# EAGLE schematic SARA-R5 (EAGLE 9.5.1)

## Sheet 1 of 2
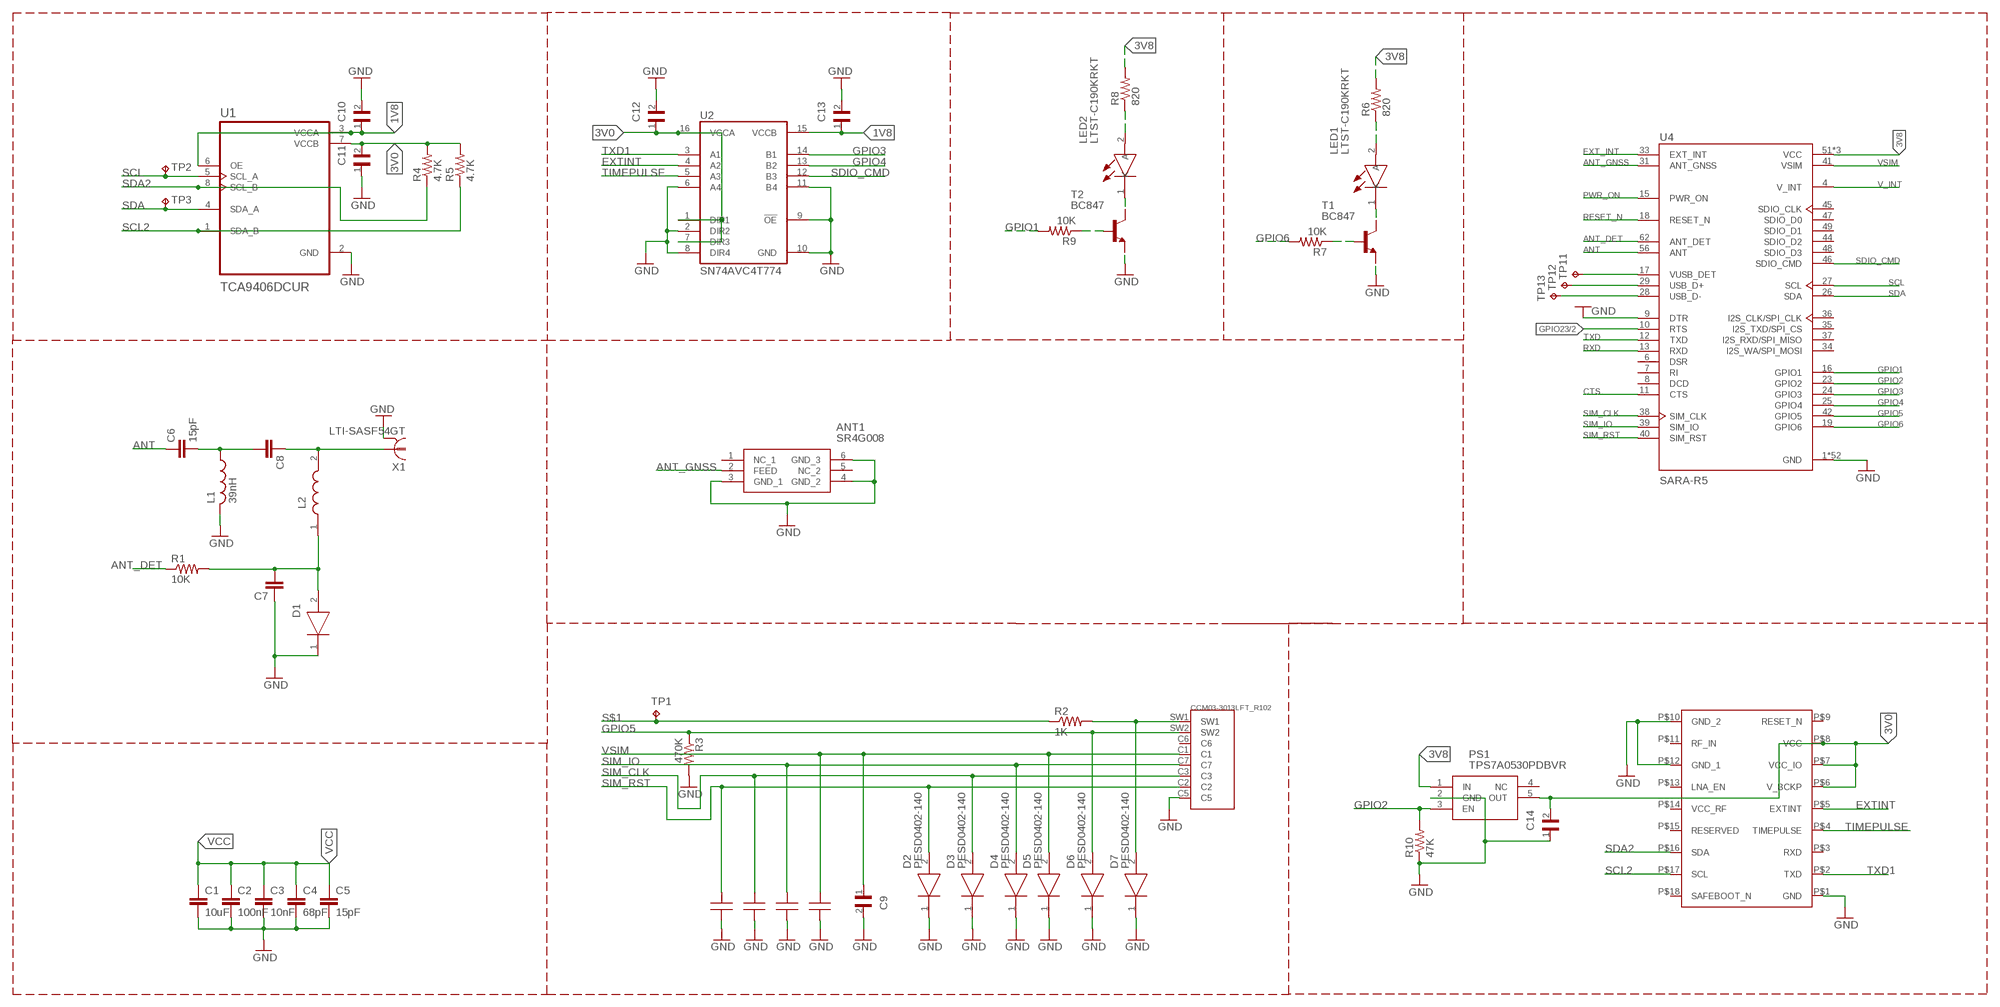
[diagram p0: schematic, sheet 1]

### Parts
ANT1  SR4G008  [SR4G008]
C1  10uF  C-EUC0402  [C0402]
C2  100nF  C-EUC0402  [C0402]
C3  10nF  C-EUC0402  [C0402]
C4  68pF  C-EUC0402  [C0402]
C5  15pF  C-EUC0402  [C0402]
C6  15pF  C-EUC0402  [C0402]
C7  27pF GRM1555C1H270JA16  C-EUC0402  [C0402]
C8  33pF GRM1555C1H330JA16  C-EUC0402  [C0402]
C9  GCM155R71C104KA55J  [CAPC1005X55N]
C10  GCM155R71C104KA55J  [CAPC1005X55N]
C11  GCM155R71C104KA55J  [CAPC1005X55N]
C12  GCM155R71C104KA55J  [CAPC1005X55N]
C13  GCM155R71C104KA55J  [CAPC1005X55N]
C14  GCM155R71C104KA55J  [CAPC1005X55N]
D1  PESD0402-140  [DIONC1005X43N]
D2  PESD0402-140  [DIONC1005X43N]
D3  PESD0402-140  [DIONC1005X43N]
D4  PESD0402-140  [DIONC1005X43N]
D5  PESD0402-140  [DIONC1005X43N]
D6  PESD0402-140  [DIONC1005X43N]
D7  PESD0402-140  [DIONC1005X43N]
L1  39nH  L-USL0402  [L0402]
L2  LQG15HS68NJ02B  [LQG15WH0N7B02D]
LED1  LTST-C190KRKT  [LEDC1608X80N]
LED2  LTST-C190KRKT  [LEDC1608X80N]
PS1  TPS7A0530PDBVR  [SOT95P280X145-5N]
R1  10K  R-US_R0402  [R0402]
R2  1K  R-US_R0402  [R0402]
R3  470K  R-US_R0402  [R0402]
R4  4.7K  R-US_R0402  [R0402]
R5  4.7K  R-US_R0402  [R0402]
R6  820  R-US_R0402  [R0402]
R7  10K  R-US_R0402  [R0402]
R8  820  R-US_R0402  [R0402]
R9  10K  R-US_R0402  [R0402]
R10  47K  R-US_R0402  [R0402]
T1  BC847  [SOT23]
T2  BC847  [SOT23]
TP1  TPB2,54  [B2,54]
TP2  TPB1,27  [B1,27]
TP3  TPB1,27  [B1,27]
TP11  TPB1,27  [B1,27]
TP12  TPB1,27  [B1,27]
TP13  TPB1,27  [B1,27]
U1  TCA9406DCUR  [SOP50P310X90-8N]
U2  SN74AVC4T774  [TSSOP16]
U4  SARA-R5  [SARA-R5]
U$1  GRM1555C1E680JA01  [INDC1005X45]
U$2  GRM1555C1E680JA01  [INDC1005X45]
U$3  GRM1555C1E680JA01  [INDC1005X45]
U$4  GRM1555C1E680JA01  [INDC1005X45]
U$5  MAX-8  [MAX-8]
X1  LTI-SASF54GT  [LTI-SASF54GT]
X2  CCM03-3013LFT_R102  [C&K_CCM03-3013LFTR102]

### Nets
1V8: C10.1 C13.1 U1.3(VCCA) U1.6(OE) U2.15(VCCB)
3V0: C11.2 C12.1 C14.2 PS1.5(OUT) R4.2 R5.2 U1.7(VCCB) U2.1(DIR1) U2.7(DIR3) U2.16(VCCA) U$5.P$6(V_BCKP) U$5.P$7(VCC_IO) U$5.P$8(VCC)
3V8: PS1.1(IN) R6.2 R8.2 U4.51(VCC) U4.52(VCC) U4.53(VCC)
ANT: C6.1 U4.56(ANT)
ANT_DET: R1.1 U4.62(ANT_DET)
ANT_GNSS: ANT1.2(FEED) U4.31(ANT_GNSS)
CTS: U4.11(CTS) ; also sheet 2
EXT_INT: U4.33(EXT_INT)
EXTINT: U2.4(A2) U$5.P$5(EXTINT)
GND: ANT1.3(GND_1) ANT1.4(GND_2) ANT1.6(GND_3) C1.2 C2.2 C3.2 C4.2 C5.2 C7.1 C9.2 C10.2 C11.1 C12.2 C13.2 C14.1 D1.1(K) D2.1(K) D3.1(K) D4.1(K) D5.1(K) D6.1(K) D7.1(K) L1.2 PS1.2(GND) R3.2 R10.1 T1.2(E) T2.2(E) U1.2(GND) U2.2(DIR2) U2.6(A4) U2.8(DIR4) U2.9(!OE!) U2.10(GND) U2.11(B4) U4.1(GND) U4.3(GND) U4.5(GND) U4.9(DTR) U4.14(GND) U4.20(GND) U4.21(GND) U4.22(GND) U4.30(GND) U4.32(GND) U4.43(GND) U4.50(GND) U4.54(GND) U4.55(GND) U4.57(GND) U4.58(GND) U4.59(GND) U4.60(GND) U4.61(GND) U4.63(GND) U4.64(GND) U4.65(GND) U4.66(GND) U4.67(GND) U4.68(GND) U4.69(GND) U4.70(GND) U4.71(GND) U4.72(GND) U4.73(GND) U4.74(GND) U4.75(GND) U4.76(GND) U4.77(GND) U4.78(GND) U4.79(GND) U4.80(GND) U4.81(GND) U4.82(GND) U4.83(GND) U4.84(GND) U4.85(GND) U4.86(GND) U4.87(GND) U4.88(GND) U4.89(GND) U4.90(GND) U4.91(GND) U4.92(GND) U4.93(GND) U4.94(GND) U4.95(GND) U4.96(GND) U$1.2 U$2.2 U$3.2 U$4.2 U$5.P$1(GND) U$5.P$10(GND_2) U$5.P$12(GND_1) X1.2 X1.3 X1.4 X1.5 X2.C5 ; also sheet 2
GPIO1: R9.2 U4.16(GPIO1)
GPIO2: PS1.3(EN) R10.2 U4.23(GPIO2)
GPIO3: U2.14(B1) U4.24(GPIO3)
GPIO4: U2.13(B2) U4.25(GPIO4)
GPIO5: D6.2(A) R3.1 U4.42(GPIO5) X2.SW2
GPIO6: R7.2 U4.19(GPIO6)
GPIO23: U4.10(RTS) ; also sheet 2
N$1: C7.2 D1.2(A) L2.1 R1.2
N$2: C6.2 C8.2 L1.1
N$3: D7.2(A) R2.2 X2.SW1
N$4: LED1.2(A) R6.1
N$5: C8.1 L2.2 X1.1
N$6: LED1.1(K) T1.3(C)
N$7: R7.1 T1.1(B)
N$8: LED2.2(A) R8.1
N$9: LED2.1(K) T2.3(C)
N$10: R9.1 T2.1(B)
N$49: TP11.TP U4.17(VUSB_DET)
N$50: TP12.TP U4.29(USB_D+)
N$51: TP13.TP U4.28(USB_D-)
PWR_ON: U4.15(PWR_ON) ; also sheet 2
RESET_N: U4.18(RESET_N) ; also sheet 2
RXD: U4.13(RXD) ; also sheet 2
S$1: R2.1 TP1.TP
SCL: TP2.TP U1.5(SCL_A) U4.27(SCL)
SCL2: R5.1 U1.1(SDA_B) U$5.P$17(SCL)
SDA: TP3.TP U1.4(SDA_A) U4.26(SDA)
SDA2: R4.1 U1.8(SCL_B) U$5.P$16(SDA)
SDIO_CMD: U2.12(B3) U4.46(SDIO_CMD)
SIM_CLK: D3.2(A) U4.38(SIM_CLK) U$2.1 X2.C3
SIM_IO: D4.2(A) U4.39(SIM_IO) U$3.1 X2.C7
SIM_RST: D2.2(A) U4.40(SIM_RST) U$1.1 X2.C2
TIMEPULSE: U2.5(A3) U$5.P$4(TIMEPULSE)
TXD: U4.12(TXD) ; also sheet 2
TXD1: U2.3(A1) U$5.P$2(TXD)
V_INT: U4.4(V_INT)
VCC: C1.1 C2.1 C3.1 C4.1 C5.1
VSIM: C9.1 D5.2(A) U4.41(VSIM) U$4.1 X2.C1
Unconnected: ANT1.1(NC_1) ANT1.5(NC_2) PS1.4(NC) U4.6(DSR) U4.7(RI) U4.8(DCD) U4.34(I2S_WA/SPI_MOSI) U4.35(I2S_TXD/SPI_CS) U4.36(I2S_CLK/SPI_CLK) U4.37(I2S_RXD/SPI_MISO) U4.44(SDIO_D2) U4.45(SDIO_CLK) U4.47(SDIO_D0) U4.48(SDIO_D3) U4.49(SDIO_D1) U$5.P$3(RXD) U$5.P$9(RESET_N) U$5.P$11(RF_IN) U$5.P$13(LNA_EN) U$5.P$14(VCC_RF) U$5.P$15(RESERVED) U$5.P$18(SAFEBOOT_N) X2.C6

## Sheet 2 of 2
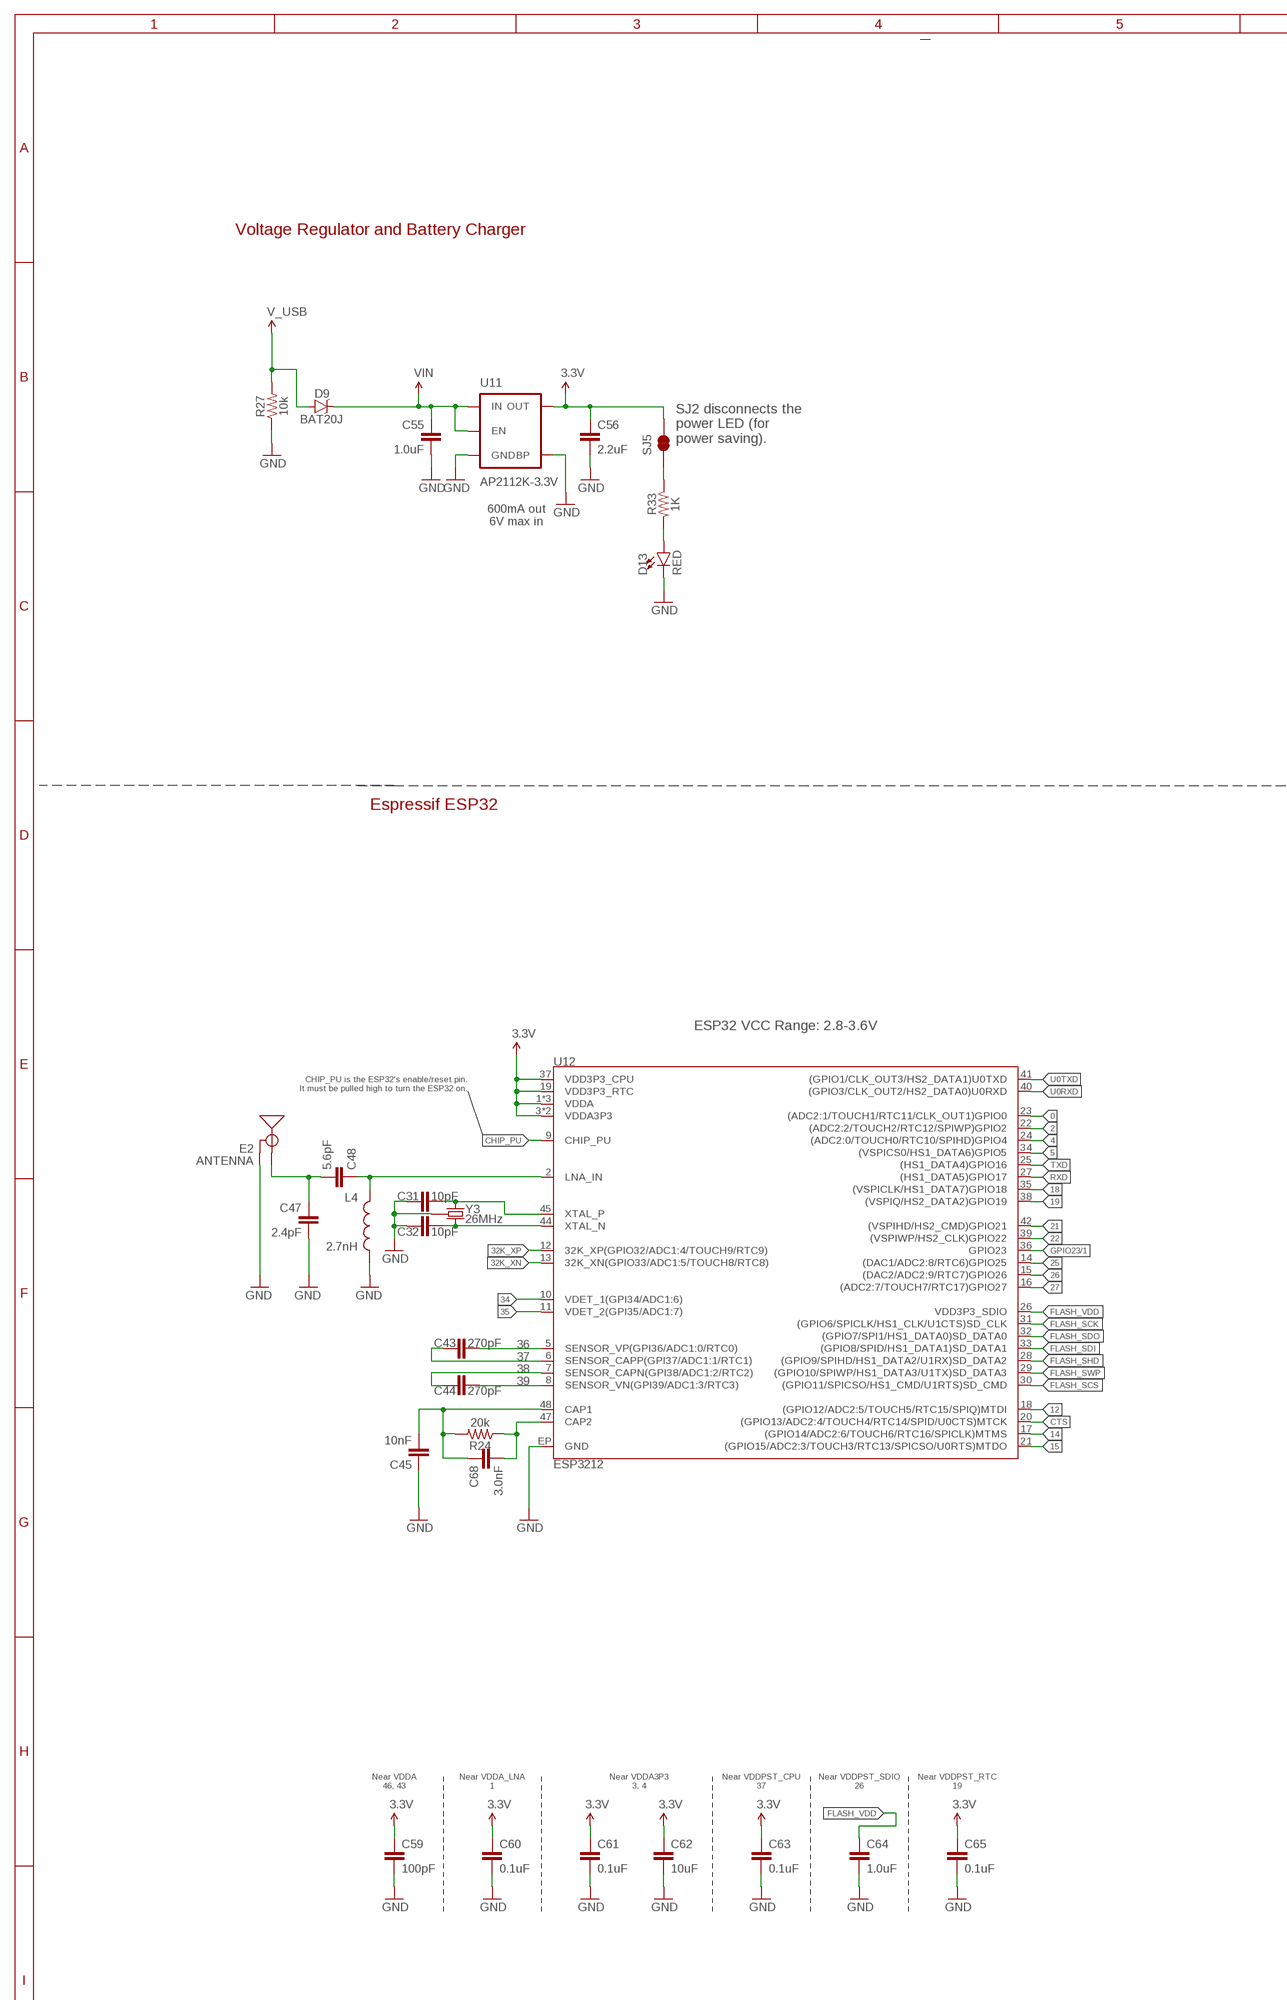
[diagram p1: schematic, sheet 2, part 1 of 2]
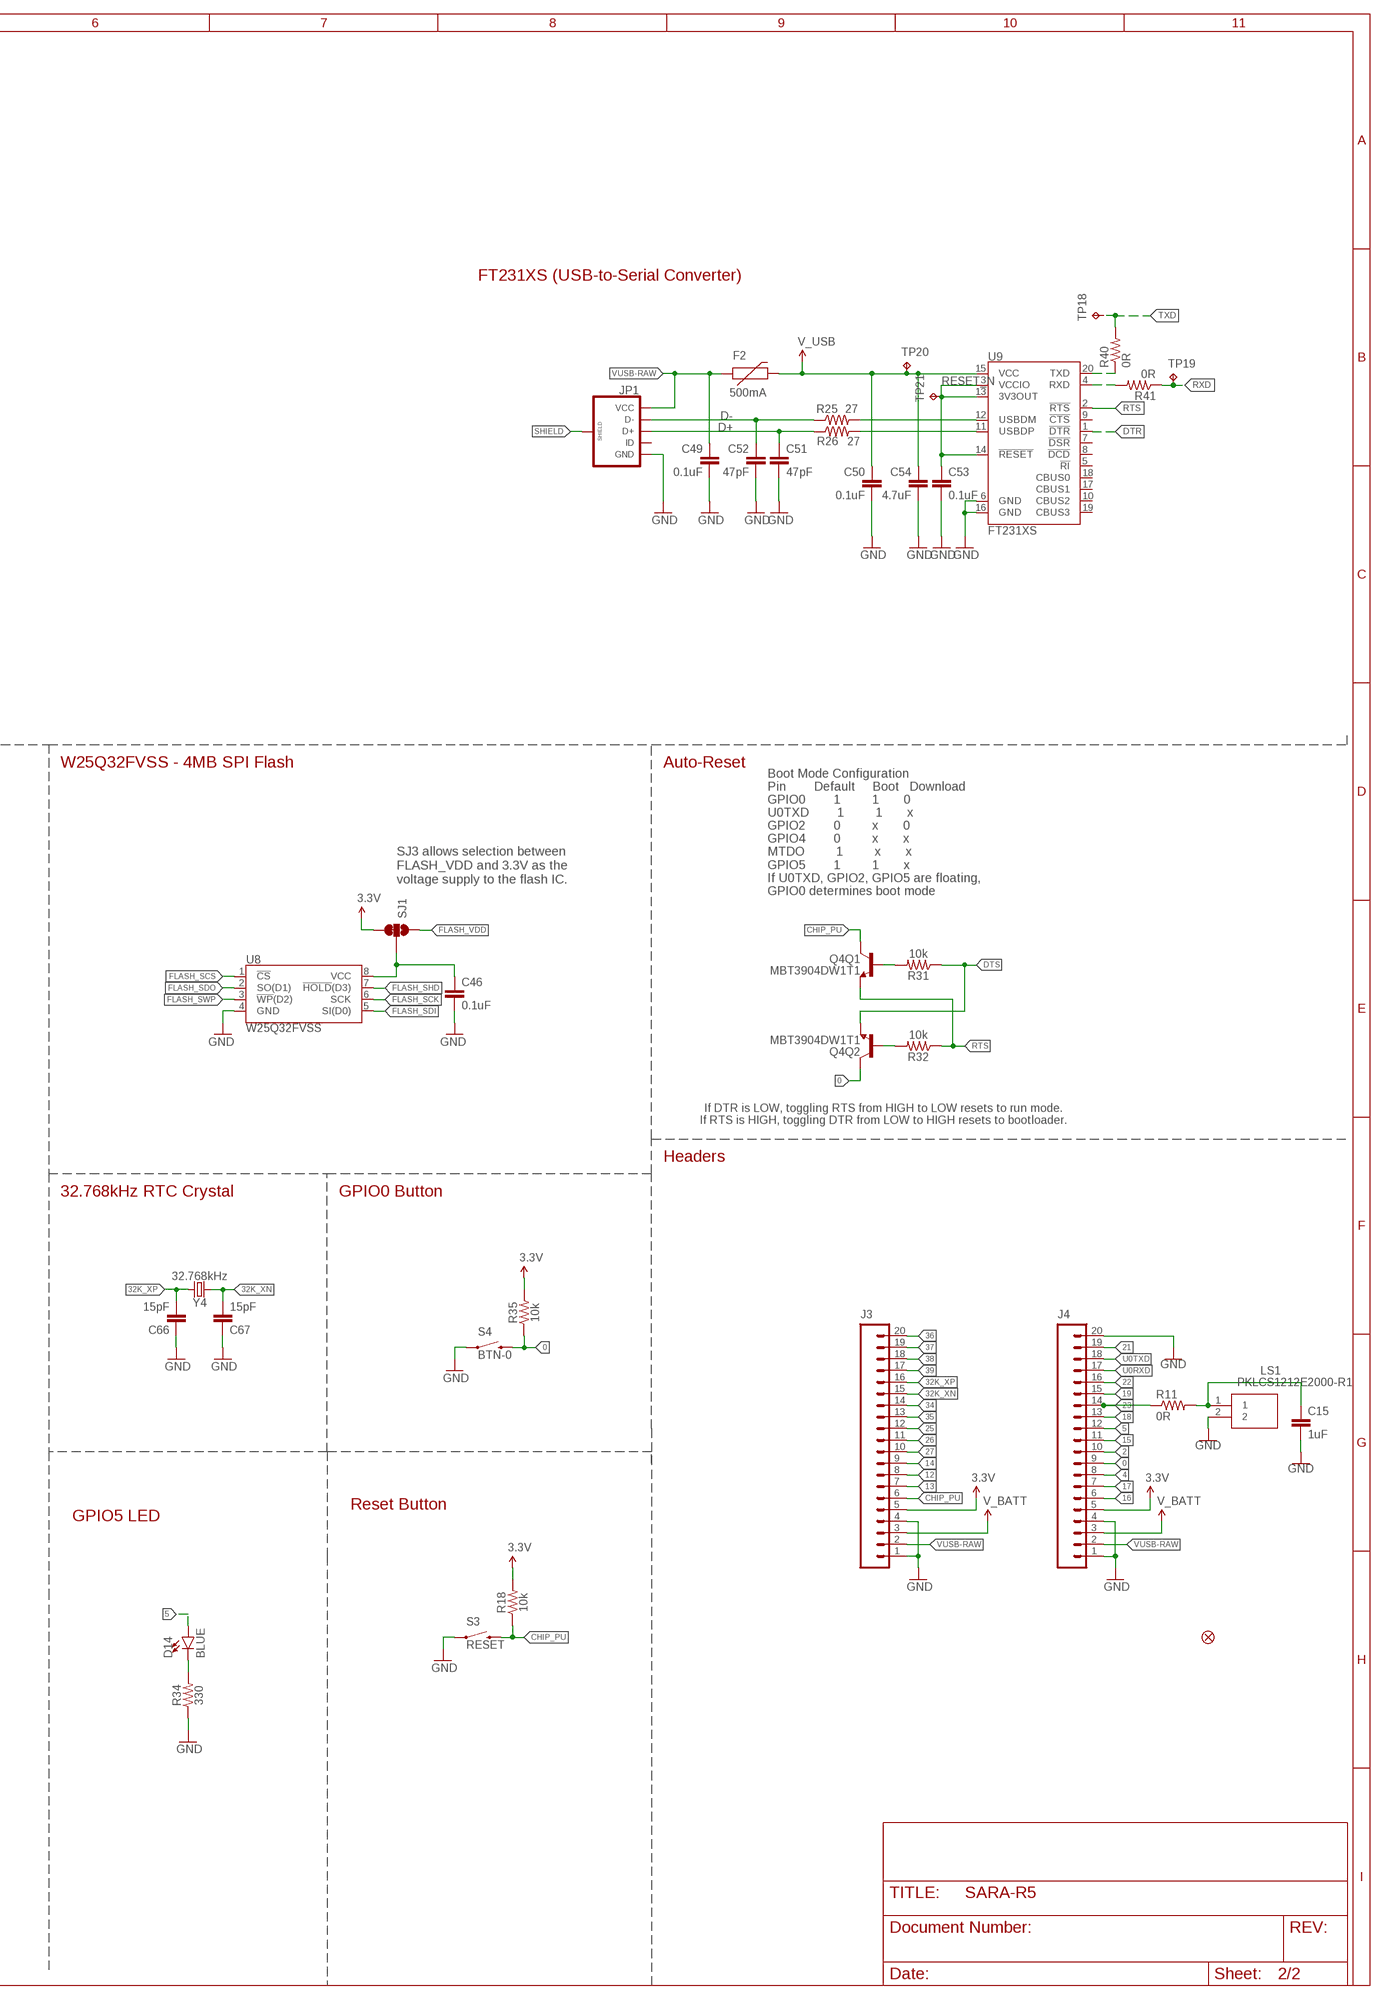
[diagram p2: schematic, sheet 2, part 2 of 2]

### Parts
C15  1uF  C-EUC0402  [C0402]
C31  10pF  10PF-0603-50V-5%  [0603]
C32  10pF  10PF-0603-50V-5%  [0603]
C43  270pF  270PF-50V-5%(0603)  [0603]
C44  270pF  270PF-50V-5%(0603)  [0603]
C45  10nF  10NF-0603-50V-10%  [0603]
C46  0.1uF  0.1UF-0603-25V-(+80/-20%)  [0603]
C47  2.4pF  2.4PF-0603-50V-5%  [0603]
C48  5.6pF  5.6PF-50V-5%(0603)  [0603]
C49  0.1uF  0.1UF-0603-25V-(+80/-20%)  [0603]
C50  0.1uF  0.1UF-0603-25V-(+80/-20%)  [0603]
C51  47pF  47PF-0603-50V-5%  [0603]
C52  47pF  47PF-0603-50V-5%  [0603]
C53  0.1uF  0.1UF-0603-25V-(+80/-20%)  [0603]
C54  4.7uF  4.7UF-6.3V-10%(0603)0603  [0603-CAP]
C55  1.0uF  1.0UF-0805-25V-(+80/-20%)  [0805]
C56  2.2uF  2.2UF-0603-10V-20%  [0603]
C59  100pF  100PF-0603-50V-5%  [0603]
C60  0.1uF  0.1UF-0603-25V-(+80/-20%)  [0603]
C61  0.1uF  0.1UF-0603-25V-(+80/-20%)  [0603]
C62  10uF  10UF-0603-6.3V-20%  [0603]
C63  0.1uF  0.1UF-0603-25V-(+80/-20%)  [0603]
C64  1.0uF  1.0UF-0603-16V-10%  [0603]
C65  0.1uF  0.1UF-0603-25V-(+80/-20%)  [0603]
C66  15pF  15PF-0603-50V-5%  [0603]
C67  15pF  15PF-0603-50V-5%  [0603]
C68  3.0nF  3.0NF-0603-50V-5%  [0603]
D9  BAT20J  DIODE-SCHOTTKY-BAT20J  [SOD-323]
D13  RED  LED-RED0603  [LED-0603]
D14  BLUE  LED-BLUE0603  [LED-0603]
E2  ANTENNA  ANTENNATRACE-TUNED  [TRACE_ANTENNA_2.4GHZ_25.7MM_TUNED]
F2  500mA  PTCSMD  [PTC-1206]
FD3  FIDUCIALUFIDUCIAL  [MICRO-FIDUCIAL]
J3  M20NOSILK  [1X20_NOSILK]
J4  M20NOSILK  [1X20_NOSILK]
JP1  USB_MICROB_PLUGCONN-11752  [USB-B-MICRO-SMD_V03]
L4  2.7nH  INDUCTOR0603  [0603]
LS1  PKLCS1212E2000-R1  [PKLCS1212E2000-R1]
Q4  MBT3904DW1T1  [SC70-6]
R11  0R  R-US_R0402  [R0402]
R18  10k  10KOHM-1/10W-1%(0603)0603  [0603]
R24  20k  20KOHM-0603-1/10W-1%  [0603]
R25  27  27OHM1/10W1%(0603)0603-RES  [0603]
R26  27  27OHM1/10W1%(0603)0603-RES  [0603]
R27  10k  10KOHM-0603-1/10W-1%  [0603]
R31  10k  10KOHM-0603-1/10W-1%  [0603]
R32  10k  10KOHM-0603-1/10W-1%  [0603]
R33  1K  1KOHM-1/10W-1%(0603)  [0603]
R34  330  330OHM1/10W1%(0603)  [0603]
R35  10k  10KOHM-1/10W-1%(0603)0603  [0603]
R40  0R  R-US_R0402  [R0402]
R41  0R  R-US_R0402  [R0402]
S3  RESET  SWITCH-MOMENTARY-2SMD-4.6X2.8MM  [TACTILE_SWITCH_SMD_4.6X2.8MM]
S4  BTN-0  SWITCH-MOMENTARY-2SMD-4.6X2.8MM  [TACTILE_SWITCH_SMD_4.6X2.8MM]
SJ1  JUMPER-PAD-3-2OF3_NC_BY_TRACE_SMALL  [PAD-JUMPER-3-2OF3_NC_BY_TRACE_YES_SILK_FULL_BOX]
SJ5  JUMPER-PAD-2-NC_BY_TRACE  [PAD-JUMPER-2-NC_BY_TRACE_YES_SILK]
TP18  TPB1,27  [B1,27]
TP19  TPB1,27  [B1,27]
TP20  TPB1,27  [B1,27]
TP21  TPB1,27  [B1,27]
U8  W25Q32FVSS  [SOIC-8]
U9  FT231XS  [SSOP20_L]
U11  AP2112K-3.3V  V_REG_LDOSMD  [SOT23-5]
U12  ESP3212  [QFN48-0.4MM]
Y3  26MHz  CRYSTAL-GROUNDED3.2X2.5  [CRYSTAL-SMD-3.2X2.5]
Y4  32.768kHz  CRYSTAL-32.768KHZSMD-3.2X1.5  [CRYSTAL-SMD-3.2X1.5MM]

### Nets
0: J4.9 Q4.6(Q2:C) R35.1 S4.3 S4.4 U12.23((ADC2:1/TOUCH1/RTC11/CLK_OUT1)GPIO0)
2: J4.10 U12.22((ADC2:2/TOUCH2/RTC12/SPIWP)GPIO2)
3.3V: C56.1 C59.1 C60.1 C61.1 C62.1 C63.1 C65.1 J3.5 J4.5 R18.2 R35.2 SJ1.3 SJ5.2 U11.5(OUT) U12.1(VDDA) U12.3(VDDA3P3) U12.4(VDDA3P3) U12.19(VDD3P3_RTC) U12.37(VDD3P3_CPU) U12.43(VDDA) U12.46(VDDA)
4: J4.8 U12.24((ADC2:0/TOUCH0/RTC10/SPIHD)GPIO4)
5: D14.A J4.12 U12.34((VSPICS0/HS1_DATA6)GPIO5)
12: J3.8 U12.18((GPIO12/ADC2:5/TOUCH5/RTC15/SPIQ)MTDI)
13: J3.7
14: J3.9 U12.17((GPIO14/ADC2:6/TOUCH6/RTC16/SPICLK)MTMS)
15: J4.11 U12.21((GPIO15/ADC2:3/TOUCH3/RTC13/SPICSO/U0RTS)MTDO)
16: J4.6
17: J4.7
18: J4.13 U12.35((VSPICLK/HS1_DATA7)GPIO18)
19: J4.15 U12.38((VSPIQ/HS2_DATA2)GPIO19)
21: J4.19 U12.42((VSPIHD/HS2_CMD)GPIO21)
22: J4.16 U12.39((VSPIWP/HS2_CLK)GPIO22)
23: C15.1 J4.14 LS1.1 R11.1 R11.2
25: J3.12 U12.14((DAC1/ADC2:8/RTC6)GPIO25)
26: J3.11 U12.15((DAC2/ADC2:9/RTC7)GPIO26)
27: J3.10 U12.16((ADC2:7/TOUCH7/RTC17)GPIO27)
32K_XN: C67.2 J3.15 U12.13(32K_XN(GPIO33/ADC1:5/TOUCH8/RTC8)) Y4.P$2
32K_XP: C66.2 J3.16 U12.12(32K_XP(GPIO32/ADC1:4/TOUCH9/RTC9)) Y4.P$1
34: J3.14 U12.10(VDET_1(GPI34/ADC1:6))
35: J3.13 U12.11(VDET_2(GPI35/ADC1:7))
36: C43.2 J3.20 U12.5(SENSOR_VP(GPI36/ADC1:0/RTC0))
37: C43.1 J3.19 U12.6(SENSOR_CAPP(GPI37/ADC1:1/RTC1))
38: C44.1 J3.18 U12.7(SENSOR_CAPN(GPI38/ADC1:2/RTC2))
39: C44.2 J3.17 U12.8(SENSOR_VN(GPI39/ADC1:3/RTC3))
CAP_10N1: C45.2 C68.1 R24.2 U12.48(CAP1)
CHIP_PU: J3.6 Q4.3(Q1:C) R18.1 S3.3 S3.4 U12.9(CHIP_PU)
CTS: U12.20((GPIO13/ADC2:4/TOUCH4/RTC14/SPID/U0CTS)MTCK) ; also sheet 1
D+: C51.1 JP1.D+ R26.1
D-: C52.1 JP1.D- R25.1
DTR: U9.1(!DTR)
DTS: Q4.1(Q2:E) R31.1
FLASH_SCK: U8.6(SCK) U12.31((GPIO6/SPICLK/HS1_CLK/U1CTS)SD_CLK)
FLASH_SCS: U8.1(!CS!) U12.30((GPIO11/SPICSO/HS1_CMD/U1RTS)SD_CMD)
FLASH_SDI: U8.5(SI(D0)) U12.33((GPIO8/SPID/HS1_DATA1)SD_DATA1)
FLASH_SDO: U8.2(SO(D1)) U12.32((GPIO7/SPI1/HS1_DATA0)SD_DATA0)
FLASH_SHD: U8.7(!HOLD!(D3)) U12.28((GPIO9/SPIHD/HS1_DATA2/U1RX)SD_DATA2)
FLASH_SWP: U8.3(!WP!(D2)) U12.29((GPIO10/SPIWP/HS1_DATA3/U1TX)SD_DATA3)
FLASH_VDD: C64.1 SJ1.1 U12.26(VDD3P3_SDIO)
GND: C15.2 C31.1 C32.1 C45.1 C46.2 C47.2 C49.2 C50.2 C51.2 C52.2 C53.2 C54.2 C55.2 C56.2 C59.2 C60.2 C61.2 C62.2 C63.2 C64.2 C65.2 C66.1 C67.1 D13.C E2.GND E2.GND2(GND) J3.1 J3.4 J4.1 J4.4 J4.20 JP1.GND L4.2 LS1.2 R27.1 R34.1 S3.1 S3.2 S4.1 S4.2 U8.4(GND) U9.6(GND) U9.16(GND) U11.2(GND) U11.4(BP) U12.EP(GND) Y3.2(GND) Y3.4(GND) ; also sheet 1
GPIO23: U12.36(GPIO23) ; also sheet 1
LNA_IN1: C48.1 L4.1 U12.2(LNA_IN)
N$15: C46.1 SJ1.2 U8.8(VCC)
N$17: R25.2 U9.12(USBDM)
N$24: R26.2 U9.11(USBDP)
N$39: Q4.5(Q1:B) R31.2
N$40: Q4.2(Q2:B) R32.2
N$41: C31.2 U12.45(XTAL_P) Y3.1
N$42: C32.2 U12.44(XTAL_N) Y3.3
N$43: D13.A R33.2
N$44: R33.1 SJ5.1
N$45: D14.C R34.2
N$46: C68.2 R24.1 U12.47(CAP2)
N$54: R40.1 U9.20(TXD)
N$55: R41.2 U9.4(RXD)
PWR_ON: C50.1 C54.1 F2.2 TP20.TP U9.15(VCC) ; supply symbol labelled V_USB ; also sheet 1
RESET_N: C53.1 TP21.TP U9.3(VCCIO) U9.13(3V3OUT) U9.14(!RESET) ; also sheet 1
RTS: Q4.4(Q1:E) R32.1 U9.2(!RTS)
RXD: R41.1 TP19.TP U12.27((HS1_DATA5)GPIO17) ; also sheet 1
SHIELD: JP1.SHIELD1(SHIELD) JP1.SHIELD2(SHIELD) JP1.SHIELD3(SHIELD)
TRACE_ANT1: C47.1 C48.2 E2.ANT(SIGNAL)
TXD: R40.2 TP18.TP U12.25((HS1_DATA4)GPIO16) ; also sheet 1
U0RXD: J4.17 U12.40((GPIO3/CLK_OUT2/HS2_DATA0)U0RXD)
U0TXD: J4.18 U12.41((GPIO1/CLK_OUT3/HS2_DATA1)U0TXD)
V_BATT: J3.3 J4.3
V_USB: D9.A R27.2
VIN: C55.1 D9.C U11.1(IN) U11.3(EN)
VUSB-RAW: C49.1 F2.1 J3.2 J4.2 JP1.VBUS(VCC)
Unconnected: JP1.ID U9.5(!RI) U9.7(!DSR) U9.8(!DCD) U9.9(!CTS) U9.10(CBUS2) U9.17(CBUS1) U9.18(CBUS0) U9.19(CBUS3)

### Notes on the sheet
- Voltage Regulator and Battery Charger
- FT231XS (USB-to-Serial Converter)
- SJ2 disconnects the
  power LED (for 
  power saving).
- 600mA out
  6V max in
- Espressif ESP32 | W25Q32FVSS - 4MB SPI Flash | Auto-Reset
- SJ3 allows selection between 
  FLASH_VDD and 3.3V as the
  voltage supply to the flash IC.
- Boot Mode Configuration
  Pin        Default     Boot   Download
  GPIO0        1         1       0
  U0TXD        1         1       x
  GPIO2        0         x       0
  GPIO4        0         x       x
  MTDO         1         x       x
  GPIO5        1         1       x
  If U0TXD, GPIO2, GPIO5 are floating, 
  GPIO0 determines boot mode
- ESP32 VCC Range: 2.8-3.6V
- CHIP_PU is the ESP32's enable/reset pin.
  It must be pulled high to turn the ESP32 on.
- If DTR is LOW, toggling RTS from HIGH to LOW resets to run mode.
  If RTS is HIGH, toggling DTR from LOW to HIGH resets to bootloader.
- Headers
- 32.768kHz RTC Crystal | GPIO0 Button
- Reset Button
- GPIO5 LED
- Near VDDA
  46, 43
- Near VDDA_LNA
  1
- Near VDDA3P3
  3, 4
- Near VDDPST_CPU
  37
- Near VDDPST_SDIO
  26
- Near VDDPST_RTC
  19

## Library data of the parts
ANT1 = SR4G008:SR4G008: Antennas 1559-1609MHz Avg. Eff >75% Linear Source: Datasheet <https://componentsearchengine.com/Datasheets/1/SR4G008.pdf>; ARROW_PART_NUMBER: SR4G008; ARROW_PRICE-STOCK: https://www.arrow.com/en/products/sr4g008/antenova; DESCRIPTION: Antennas 1559-1609MHz Avg. Eff >75% Linear; HEIGHT: mm; MANUFACTURER_NAME: Antenova; MANUFACTURER_PART_NUMBER: SR4G008; MOUSER_PART_NUMBER: 237-SR4G008; MOUSER_PRICE-STOCK: https://www.mouser.co.uk/ProductDetail/Antenova/SR4G008?qs=vyIerDHf%2Fmn%2FnBMYNSbzrA%3D%3D
C1-C8 C15 = rcl:C-EU: CAPACITOR, European symbol; SPICEPREFIX: C
C9-C14 = GCM155R71C104KA55J:GCM155R71C104KA55J: Cap Ceramic 0.1uF 16V X7R 10% Pad SMD 0402 125°C Automotive T/R; ARROW_ELECTRONICS-PURCHASE-URL: https://snapeda.com/shop?store=Arrow+Electronics&id=4387514; DESCRIPTION: SMD Capacitor X7R(EIA) with Capacitance: 0.10uF Tol. 10%. Rated Voltage: 16Vdc; DIGIKEY-PURCHASE-URL: https://snapeda.com/shop?store=DigiKey&id=4387514; MF: Murata; MOUSER-PURCHASE-URL: https://snapeda.com/shop?store=Mouser&id=4387514; MP: GCM155R71C104KA55J; PACKAGE: 1005 Taiyo Yuden
C31 C32 = SparkFun-Capacitors:10PF: 10pF ceramic capacitors A capacitor is a passive two-terminal electrical component used to store electrical energy temporarily in an electric field.; PROD_ID: CAP-11812
C43 C44 = esp32-thing-temp:270PF-50V-5%(0603): CAP-13339; PROD_ID: CAP-13339
C45 = SparkFun-Capacitors:10NF: 0.01uF/10nF/10,000pF ceramic capacitors A capacitor is a passive two-terminal electrical component used to store electrical energy temporarily in an electric field. CAP-09321; PROD_ID: CAP-00867
C46 C49 C50 C53 C60 C61 C63 C65 = SparkFun-Capacitors:0.1UF: 0.1µF ceramic capacitors A capacitor is a passive two-terminal electrical component used to store electrical energy temporarily in an electric field.; PROD_ID: CAP-00810
C47 = esp32-thing-temp:2.4PF: 2.4pF ceramic capacitors A capacitor is a passive two-terminal electrical component used to store electrical energy temporarily in an electric field.; PROD_ID: CAP-13541
C48 = esp32-thing-temp:5.6PF-50V-5%(0603): CAP-12456; PROD_ID: CAP-12456
C51 C52 = SparkFun-Capacitors:47PF: 47pF ceramic capacitors A capacitor is a passive two-terminal electrical component used to store electrical energy temporarily in an electric field.; PROD_ID: CAP-08913
C54 = SparkFun-Capacitors:4.7UF-6.3V-10%(0603): CAP-08280; PROD_ID: CAP-08280
C55 = SparkFun-Capacitors:1.0UF: 1µF ceramic capacitors A capacitor is a passive two-terminal electrical component used to store electrical energy temporarily in an electric field.; PROD_ID: CAP-11625
C56 = SparkFun-Capacitors:2.2UF: 2.2µF ceramic capacitors A capacitor is a passive two-terminal electrical component used to store electrical energy temporarily in an electric field.; PROD_ID: CAP-07888
C59 = SparkFun-Capacitors:100PF: 100pF/0.1nF ceramic capacitors A capacitor is a passive two-terminal electrical component used to store electrical energy temporarily in an electric field.; PROD_ID: CAP-07883
C62 = SparkFun-Capacitors:10UF: 10.0µF ceramic capacitors A capacitor is a passive two-terminal electrical component used to store electrical energy temporarily in an electric field.; PROD_ID: CAP-11015
C64 = SparkFun-Capacitors:1.0UF: 1µF ceramic capacitors A capacitor is a passive two-terminal electrical component used to store electrical energy temporarily in an electric field.; PROD_ID: CAP-00868
C66 C67 = SparkFun-Capacitors:15PF: 15pF ceramic capacitors A capacitor is a passive two-terminal electrical component used to store electrical energy temporarily in an electric field.; PROD_ID: CAP-07881
C68 = esp32-thing-temp:3.0NF: 3.0nF (3nF, 3000pF) ceramic capacitors A capacitor is a passive two-terminal electrical component used to store electrical energy temporarily in an electric field.; PROD_ID: CAP-13515
D1-D7 = PESD0402-140:PESD0402-140: TVS Diode Bi-Directional PESD0402-140 40V, SOD-923 2-Pin Source: Datasheet <http://www.te.com/commerce/DocumentDelivery/DDEController?Action=showdoc&DocId=Specification Or StandardSCD27440FpdfEnglishENG_SS_SCD27440_F.pdfRF1600-000.pdf>; ARROW_PART_NUMBER: PESD0402-140; DESCRIPTION: TVS Diode Bi-Directional PESD0402-140 40V, SOD-923 2-Pin; HEIGHT: 0.43mm; MANUFACTURER_NAME: TE Connectivity; MANUFACTURER_PART_NUMBER: PESD0402-140
D9 = SparkFun-DiscreteSemi:DIODE-SCHOTTKY: Schottky diodes in SFE's production catalog BAT20J 1A 23V 0.62Vf RB751 120mA 40V 0.37Vf PMEG4005EJ 0.5A 40V 0.42Vf MBRA140 1A 40V 0.5Vf B340A 3A 40V SMA; PROD_ID: DIO-11623
D13 = SparkFun-LED:LED-RED: Red SMD LED Used in manufacturing of most products at SparkFun 0603 - SMD 0603 package Forward Voltage: 1.9V Forward Current: 20mA Datasheet: [Product Link] <http://docs.avagotech.com/docs/AV02-0551EN> 0603 SMART - SMD 0603 SMART package ( more efficient and expensive) Forward Voltage: 1.8V Forward Current: 20mA Datasheet: [Product Link] <http://www.osram-os.com/Graphics/XPic2/00077099_0.pdf> 1206 - SMD 1206 package Forward Voltage: 2V Forward Current: 20mA Datasheet: [Product Link] <https://www.sparkfun.com/datasheets/DevTools/LilyPad/Q150OVS4.pdff> 1206 LilyPad - SMD 1206 LilyPad package Forward Voltage: 2V Forward Current: 20mA Datasheet: [Product Link] <https://www.sparkfun.com/datasheets/DevTools/LilyPad/Q150OVS4.pdf>; PROD_ID: DIO-00819
D14 = SparkFun-LED:LED-BLUE: Blue SMD LED Used in manufacturing of various products at SparkFun 0603 - SMD 0603 package Manufacturer: Rohm Semiconductor Forward Voltage: 2.9V Forward Current: 5mA Wavelength: 470nm Digikey: [Product Link] <http://www.digikey.com/product-detail/en/SMLE12BC7TT86/511-1589-2-ND/1641808> 1206 - SMD1206 package Manufacturer:Lite-On Inc. Forward Voltage: 3.3V Forward Current: 20mA Wavelength: 468nm Digikey: [Product Link] <http://www.digikey.com/product-detail/en/lite-on-inc/LTST-C150TBKT/160-1643-1-ND/573584>; PROD_ID: DIO-08575
E2 = esp32-thing-temp:ANTENNA: Chip antenna Chip antenna with ground or secondary connection. Common with larger metal RF connectors.
F2 = SparkFun-PowerIC:PTC: Resettable Fuse PTC Resettable Fuse. Spark Fun Electronics SKU : COM-08357; PROD_ID: RES-11150
FD3 = SparkFun-Aesthetics:FIDUCIAL: Fiducial Alignment Points Various fiducial points for machine vision alignment.
J3 J4 = SparkFun-Connectors:M20: 1x20 .1" header This is just like the LOCK variant in that the holes are staggared by 5 mil, but except for the last two holes. They are not altered from the "standard" footprint layout. This is used for a special purpose on the layout of our Graphic LCD Backpack. Make sure you want to use this device before selecting it for you project!
JP1 = SparkFun-Connectors:USB_MICROB_PLUG: USB Micro-B connectors Some male, some female. Watch your step!; PROD_ID: CONN-11752
L1 = rcl:L-US: INDUCTOR, American symbol
L2 = LQG15HS68NJ02B:LQG15HS68NJ02B: LQG15HS_02 Series Inductor 68nH +/-5% 0402 (1005) Source: Datasheet <https://psearch.en.murata.com/inductor/product/LQG15HS68NJ02#.html>; ARROW_PART_NUMBER: LQG15HS68NJ02B; DESCRIPTION: LQG15HS_02 Series Inductor 68nH +/-5% 0402 (1005); HEIGHT: 0.55mm; MANUFACTURER_NAME: Murata Electronics; MANUFACTURER_PART_NUMBER: LQG15HS68NJ02B
L4 = SparkFun-Passives:INDUCTOR: Inductors Basic Inductor/Choke - 0603 and 1206. Footprints are not proven and vary greatly between part numbers. INDUCTOR POWER 3.3UH 4.0A SMD 0.197" L x 0.197" W x 0.177" H (5.00mm x 5.00mm x 4.50mm); PROD_ID: NDUC-08762
LED1 LED2 = LTST-C190KRKT:LTST-C190KRKT: LED,SMD,0603,Red,54mcd,130deg Lite-On LTST-C190KRKT Red LED, 631 nm, 1608 (0603), Rectangle Lens SMD Package Source: Datasheet <https://componentsearchengine.com/Datasheets/1/LTST-C190KRKT.pdf>; ARROW_PART_NUMBER: LTST-C190KRKT; ARROW_PRICE-STOCK: https://www.arrow.com/en/products/ltst-c190krkt/lite-on-technology; DESCRIPTION: LED,SMD,0603,Red,54mcd,130deg Lite-On LTST-C190KRKT Red LED, 631 nm, 1608 (0603), Rectangle Lens SMD Package; HEIGHT: 0.8mm; MANUFACTURER_NAME: Lite-On; MANUFACTURER_PART_NUMBER: LTST-C190KRKT; MOUSER_PART_NUMBER: 859-LTST-C190KRKT; MOUSER_PRICE-STOCK: https://www.mouser.co.uk/ProductDetail/Lite-On/LTST-C190KRKT?qs=kAD5fFa1n5VY3YYNWPC1Fg%3D%3D
LS1 = PKLCS1212E2000-R1:PKLCS1212E2000-R1: Buzzer Piezo 3Vpp 70dB SMD Murata 70dB SMD Buzzer External Piezo Buzzer Transducer, 2000 Hz Source: Datasheet <http://www.murata.com/~/media/webrenewal/support/library/catalog/products/sound/p37e.ashx>; ARROW_PART_NUMBER: PKLCS1212E2000-R1; ARROW_PRICE-STOCK: https://www.arrow.com/en/products/pklcs1212e2000-r1/murata-manufacturing; DESCRIPTION: Buzzer Piezo 3Vpp 70dB SMD Murata 70dB SMD Buzzer External Piezo Buzzer Transducer, 2000 Hz; HEIGHT: mm; MANUFACTURER_NAME: Murata Electronics; MANUFACTURER_PART_NUMBER: PKLCS1212E2000-R1; MOUSER_PART_NUMBER: 81-PKLCS1212E2000-R1; MOUSER_PRICE-STOCK: https://www.mouser.co.uk/ProductDetail/Murata-Electronics/PKLCS1212E2000-R1?qs=QXs58j9tPLtilMvsQD7cHw%3D%3D
PS1 = TPS7A0530PDBVR:TPS7A0530PDBVR: 1A, ultra-low Iq, 200mA low-dropout (LDO) regulator in a small-size package Source: Datasheet <http://www.ti.com/lit/gpn/tps7a05>; ARROW_PART_NUMBER: TPS7A0530PDBVR; ARROW_PRICE-STOCK: https://www.arrow.com/en/products/tps7a0530pdbvr/texas-instruments; DESCRIPTION: 1A, ultra-low Iq, 200mA low-dropout (LDO) regulator in a small-size package; HEIGHT: 1.45mm; MANUFACTURER_NAME: Texas Instruments; MANUFACTURER_PART_NUMBER: TPS7A0530PDBVR; MOUSER_PART_NUMBER: 595-TPS7A0530PDBVR; MOUSER_PRICE-STOCK: https://www.mouser.co.uk/ProductDetail/Texas-Instruments/TPS7A0530PDBVR?qs=byeeYqUIh0OXf2T23vUe3w%3D%3D
Q4 = esp32-thing-temp:MBT3904DW1T1: MBT3904DW1 Dual NPN Transistors The MBT3904W1 puts two general purpose 3904 NPN transistors in a single package. Datasheet <http://www.onsemi.com/pub_link/Collateral/MBT3904DW1T1-D.PDF>; PROD_ID: TRANS-13337
R1-R3 R11 = rcl:R-US_: RESISTOR, American symbol; SPICEPREFIX: R
R4-R10 R40 R41 = rcl:R-US_: RESISTOR, American symbol
R18 R35 = SparkFun-Resistors:10KOHM-1/10W-1%(0603): RES-00824; PROD_ID: RES-00824; VALUE: 10K
R24 = SparkFun-Resistors:20KOHM: 20kΩ resistor A resistor is a passive two-terminal electrical component that implements electrical resistance as a circuit element. Resistors act to reduce current flow, and, at the same time, act to lower voltage levels within circuits. - Wikipedia; PROD_ID: RES-09383
R25 R26 = SparkFun-Resistors:27OHM1/10W1%(0603): RES-09334; PROD_ID: RES-09334
R27 R31 R32 = SparkFun-Resistors:10KOHM: 10kΩ resistor A resistor is a passive two-terminal electrical component that implements electrical resistance as a circuit element. Resistors act to reduce current flow, and, at the same time, act to lower voltage levels within circuits. - Wikipedia; PROD_ID: RES-00824
R33 = SparkFun-Resistors:1KOHM-1/10W-1%(0603): RES-07856; PROD_ID: RES-07856
R34 = SparkFun-Resistors:330OHM1/10W1%(0603): RES-00818; PROD_ID: RES-00818
S3 S4 = SparkFun-Electromechanical:SWITCH-MOMENTARY-2: Various NO switches- pushbuttons, reed, etc; PROD_ID: SWCH-13065
SJ1 = SparkFun-Passives:JUMPER-PAD-3-2OF3_NC_BY_TRACE
SJ5 = SparkFun-Passives:JUMPER-PAD-2-NC_BY_TRACE
T1 T2 = transistor:BC847: NPN TRANSISTOR
TP1-TP3 TP11-TP13 TP18-TP21 = testpad:TP: Test pad
U1 = TCA9406DCUR:TCA9406DCUR: Buy Part <https://snapeda.com/parts/TCA9406DCUR/Texas%20Instruments/view-part/?ref=eda>; ARROW_ELECTRONICS-PURCHASE-URL: https://snapeda.com/shop?store=Arrow+Electronics&id=105450; AVAILABILITY: Good; DESCRIPTION: 2-Bit Bidirectional 1-MHz I2C Bus and SMBus Voltage-Level Shifter 8-VSSOP -40 to 85; DIGIKEY-PURCHASE-URL: https://snapeda.com/shop?store=DigiKey&id=105450; MF: Texas Instruments; MOUSER-PURCHASE-URL: https://snapeda.com/shop?store=Mouser&id=105450; MP: TCA9406DCUR; PACKAGE: VSSOP-8 Texas Instruments; PRICE: None; TEXAS_INSTRUMENTS-PURCHASE-URL: https://snapeda.com/shop?store=Texas+Instruments&id=105450
U2 = SN74AVC4T774:SN74AVC4T774: 4-Bit Dual-Supply Bus Transceiver Configurable Voltage Translation and 3-State Outputs; AVAILABILITY: Unavailable; DESCRIPTION: Voltage Level Translator Bidirectional 1 Circuit 4 Channel 380Mbps 16-TSSOP; MF: Texas Instruments; MP: SN74AVC4T774; PACKAGE: TSSOP-16 Texas Instruments; PRICE: None
U4 = SARA-R5:SARA-R5: SARA-R5; A: "; AVAILABILITY: Warning; DESCRIPTION: SARA-R5; MF: U-Blox America; MP: SARA-R5; PACKAGE: SARA-R5; PRICE: None
U8 = SparkFun-DigitalIC:W25Q32FV: Winbond W25Q32FV 32Mbit (4MB) Flash The W25Q32FV support the standard Serial Peripheral Interface (SPI), Dual/Quad I/O SPI as well as 2-clocks instruction cycle Quad Peripheral Interface (QPI). Datasheet <http://www.winbond.com/resource-files/w25q32fv%20revh%20091613.pdf>; PROD_ID: IC-13229
U9 = SparkFun-DigitalIC:FT231X: FTDI FT231X Full Speed USB to Full-handshake UART This USB2.0 Full Speed IC offers a compact bridge to full handshake UART interfaces. The device is a UART, capable of operating up to 3MBaud, with low power consumption (8mA). The FT231X includes the complete FT-X series feature set and enables USB to be added into a system design quickly and easily over a UART interface.; PROD_ID: IC-11524
U11 = SparkFun-PowerIC:V_REG_LDO: Voltage Regulator LDO Standard 150mA LDO voltage regulator in SOT-23 layout. Micrel part MIC5205. BP (by-pass) pin is used to lower output noise with 470pF cap.; PROD_ID: VREG-12457
U12 = esp32-thing-temp:ESP3212; PROD_ID: IC-13338
U$1-U$4 = GCM1555C1H470JA16:GRM1555C1E680JA01
U$5 = MAX-8:MAX-8
X1 = con-coax:LTI-SASF54GT: SMA vertical PCB thrue hole jack Source: Lighthorse Technologies, inc. SASF54GT.pdf; OC_FARNELL: unknown; OC_NEWARK: unknown
X2 = CCM03-3013LFT_R102:CCM03-3013LFT_R102: Conn SIM/SAM M 6 POS 2.54mm Solder RA SMD 1A T/R; DESCRIPTION: 8 (6 + 2) Position Card Connector SIM, SAM Card Surface Mount, Right Angle Gold; MF: C&K; MP: CCM03-3013LFT R102; PACKAGE: None
Y3 = things:CRYSTAL-GROUNDED; PROD_ID: XTAL-12454
Y4 = SparkFun-Clocks:CRYSTAL-32.768KHZ: 32.768kHz Crystal Frequency: 32.768kHz Frequency Stability: ±20ppm Load Capacitance: 12.5pF (PTH-2X6 & SMD-3.2X1.5), 6pF (SMD-2X6); PROD_ID: XTAL-13062